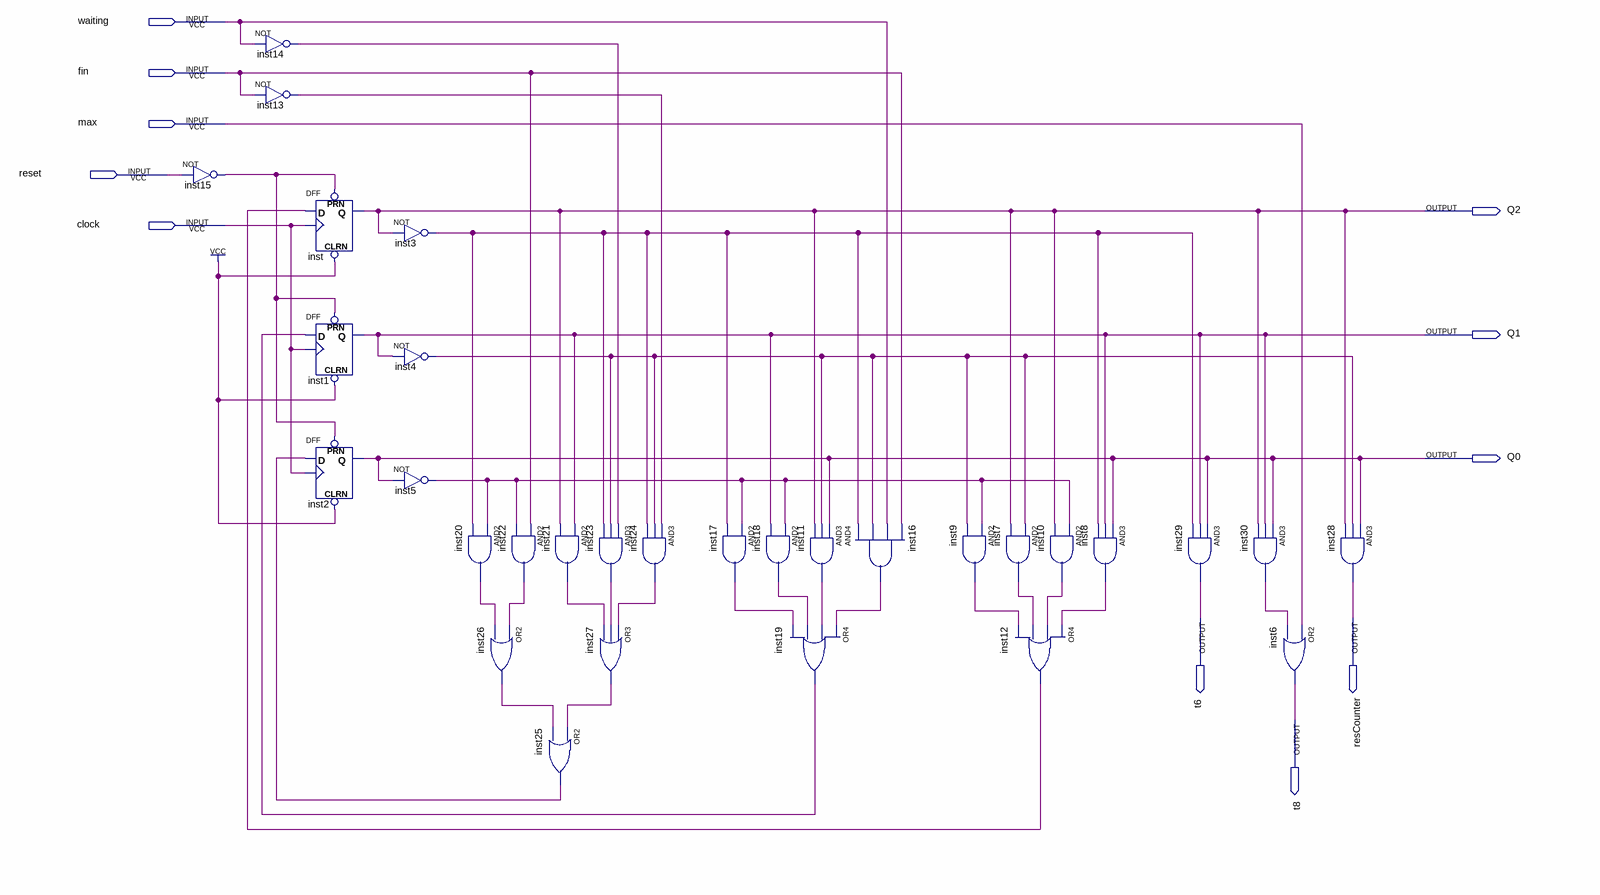
[diagram p0: schematic sheet]
// Quartus schematic traffic_light_controller.bdf as structural Verilog: 31 symbols, 11 pins
module traffic_light_controller (
  input  waiting,
  input  fin,
  input  max,
  input  reset,
  input  clock,
  output Q2,
  output Q1,
  output Q0,
  output t6,
  output resCounter,
  output t8
);

  wire inst3_out, inst4_out, inst5_out, inst7_out, inst8_out, inst9_out, inst10_out, inst11_out, inst12_out,
       inst13_out, inst14_out, inst15_out, inst16_out, inst17_out, inst18_out, inst19_out, inst20_out,
       inst21_out, inst22_out, inst23_out, inst24_out, inst25_out, inst26_out, inst27_out, inst30_out;

  not inst15 (inst15_out, reset);
  not inst14 (inst14_out, waiting);
  not inst13 (inst13_out, fin);
  DFF inst (.CLRN(1'b1), .CLK(clock), .D(inst12_out), .PRN(inst15_out), .Q(Q2));
  DFF inst1 (.CLRN(1'b1), .CLK(clock), .D(inst19_out), .PRN(inst15_out), .Q(Q1));
  DFF inst2 (.CLRN(1'b1), .CLK(clock), .D(inst25_out), .PRN(inst15_out), .Q(Q0));
  not inst3 (inst3_out, Q2);
  not inst4 (inst4_out, Q1);
  not inst5 (inst5_out, Q0);
  and inst20 (inst20_out, inst5_out, inst3_out);
  or inst26 (inst26_out, inst22_out, inst20_out);
  and inst21 (inst21_out, Q1, Q2);
  and inst22 (inst22_out, fin, inst5_out);
  or inst25 (inst25_out, inst27_out, inst26_out);
  and inst23 (inst23_out, inst14_out, inst4_out, inst3_out);
  or inst27 (inst27_out, inst24_out, inst23_out, inst21_out);
  and inst24 (inst24_out, inst13_out, inst4_out, inst3_out);
  and inst17 (inst17_out, inst5_out, inst3_out);
  and inst18 (inst18_out, inst5_out, Q1);
  or inst19 (inst19_out, inst16_out, inst11_out, inst18_out, inst17_out);
  and inst11 (inst11_out, Q0, inst4_out, Q2);
  and inst16 (inst16_out, inst3_out, inst4_out, waiting, fin);
  and inst9 (inst9_out, inst5_out, inst4_out);
  and inst7 (inst7_out, inst4_out, Q2);
  or inst12 (inst12_out, inst8_out, inst10_out, inst7_out, inst9_out);
  and inst10 (inst10_out, inst5_out, Q2);
  and inst8 (inst8_out, Q0, Q1, inst3_out);
  and inst29 (t6, Q0, Q1, inst3_out);
  and inst30 (inst30_out, Q0, Q1, Q2);
  or inst6 (t8, max, inst30_out);
  and inst28 (resCounter, Q0, inst4_out, Q2);
endmodule
